# Altium schematic sheet Ports.SchDoc
size A
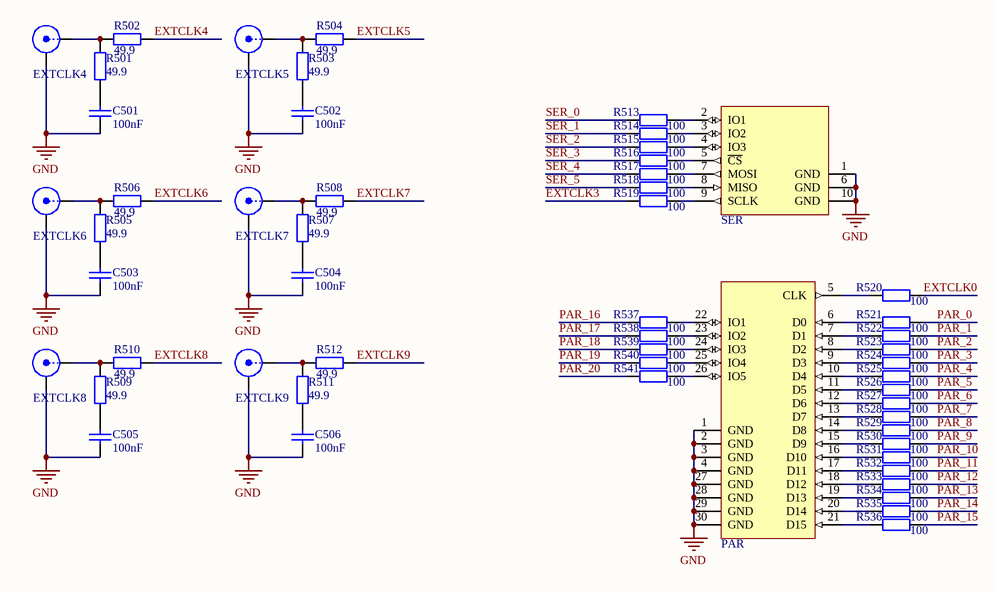
[diagram p0: Ports.SchDoc]

## Parts
C501  value 100nF  [0603C]  (hidden comment: MLCC)
C502  value 100nF  [0603C]  (hidden comment: MLCC)
C503  value 100nF  [0603C]  (hidden comment: MLCC)
C504  value 100nF  [0603C]  (hidden comment: MLCC)
C505  value 100nF  [0603C]  (hidden comment: MLCC)
C506  value 100nF  [0603C]  (hidden comment: MLCC)
EXTCLK4  SMA  [SMA-V-NARROW]  (value not drawn)
EXTCLK5  SMA  [SMA-V-NARROW]  (value not drawn)
EXTCLK6  SMA  [SMA-V-NARROW]  (value not drawn)
EXTCLK7  SMA  [SMA-V-NARROW]  (value not drawn)
EXTCLK8  SMA  [SMA-V-NARROW]  (value not drawn)
EXTCLK9  SMA  [SMA-V-NARROW]  (value not drawn)
PAR  FPGA_PAR_SLAVE  [IDC30]  (value not drawn)
R501  value 49.9  [0603R]  (hidden comment: Resistor)
R502  value 49.9  [0603R]  (hidden comment: Resistor)
R503  value 49.9  [0603R]  (hidden comment: Resistor)
R504  value 49.9  [0603R]  (hidden comment: Resistor)
R505  value 49.9  [0603R]  (hidden comment: Resistor)
R506  value 49.9  [0603R]  (hidden comment: Resistor)
R507  value 49.9  [0603R]  (hidden comment: Resistor)
R508  value 49.9  [0603R]  (hidden comment: Resistor)
R509  value 49.9  [0603R]  (hidden comment: Resistor)
R510  value 49.9  [0603R]  (hidden comment: Resistor)
R511  value 49.9  [0603R]  (hidden comment: Resistor)
R512  value 49.9  [0603R]  (hidden comment: Resistor)
R513  value 100  [0603R]  (hidden comment: Resistor)
R514  value 100  [0603R]  (hidden comment: Resistor)
R515  value 100  [0603R]  (hidden comment: Resistor)
R516  value 100  [0603R]  (hidden comment: Resistor)
R517  value 100  [0603R]  (hidden comment: Resistor)
R518  value 100  [0603R]  (hidden comment: Resistor)
R519  value 100  [0603R]  (hidden comment: Resistor)
R520  value 100  [0603R]  (hidden comment: Resistor)
R521  value 100  [0603R]  (hidden comment: Resistor)
R522  value 100  [0603R]  (hidden comment: Resistor)
R523  value 100  [0603R]  (hidden comment: Resistor)
R524  value 100  [0603R]  (hidden comment: Resistor)
R525  value 100  [0603R]  (hidden comment: Resistor)
R526  value 100  [0603R]  (hidden comment: Resistor)
R527  value 100  [0603R]  (hidden comment: Resistor)
R528  value 100  [0603R]  (hidden comment: Resistor)
R529  value 100  [0603R]  (hidden comment: Resistor)
R530  value 100  [0603R]  (hidden comment: Resistor)
R531  value 100  [0603R]  (hidden comment: Resistor)
R532  value 100  [0603R]  (hidden comment: Resistor)
R533  value 100  [0603R]  (hidden comment: Resistor)
R534  value 100  [0603R]  (hidden comment: Resistor)
R535  value 100  [0603R]  (hidden comment: Resistor)
R536  value 100  [0603R]  (hidden comment: Resistor)
R537  value 100  [0603R]  (hidden comment: Resistor)
R538  value 100  [0603R]  (hidden comment: Resistor)
R539  value 100  [0603R]  (hidden comment: Resistor)
R540  value 100  [0603R]  (hidden comment: Resistor)
R541  value 100  [0603R]  (hidden comment: Resistor)
SER  FPGA_SER_SLAVE  [IDC10]  (value not drawn)

## Nets
GND: C501.1 C502.1 C503.1 C504.1 C505.1 C506.1 EXTCLK4.2(Y) EXTCLK5.2(Y) EXTCLK6.2(Y) EXTCLK7.2(Y) EXTCLK8.2(Y) EXTCLK9.2(Y) PAR.1(GND) PAR.2(GND) PAR.3(GND) PAR.4(GND) PAR.27(GND) PAR.28(GND) PAR.29(GND) PAR.30(GND) SER.1(GND) SER.6(GND) SER.10(GND)
EXTCLK0: R520.2
EXTCLK3: R519.1
EXTCLK4: R502.2
EXTCLK5: R504.2
EXTCLK6: R506.2
EXTCLK7: R508.2
EXTCLK8: R510.2
EXTCLK9: R512.2
PAR_0: R521.2
PAR_1: R522.2
PAR_2: R523.2
PAR_3: R524.2
PAR_4: R525.2
PAR_5: R526.2
PAR_6: R527.2
PAR_7: R528.2
PAR_8: R529.2
PAR_9: R530.2
PAR_10: R531.2
PAR_11: R532.2
PAR_12: R533.2
PAR_13: R534.2
PAR_14: R535.2
PAR_15: R536.2
PAR_16: R537.1
PAR_17: R538.1
PAR_18: R539.1
PAR_19: R540.1
PAR_20: R541.1
SER_0: R513.1
SER_1: R514.1
SER_2: R515.1
SER_3: R516.1
SER_4: R517.1
SER_5: R518.1
NetC501_2: C501.2 R501.1
NetC502_2: C502.2 R503.1
NetC503_2: C503.2 R505.1
NetC504_2: C504.2 R507.1
NetC505_2: C505.2 R509.1
NetC506_2: C506.2 R511.1
NetEXTCLK4_1: EXTCLK4.1(X) R501.2 R502.1
NetEXTCLK5_1: EXTCLK5.1(X) R503.2 R504.1
NetEXTCLK6_1: EXTCLK6.1(X) R505.2 R506.1
NetEXTCLK7_1: EXTCLK7.1(X) R507.2 R508.1
NetEXTCLK8_1: EXTCLK8.1(X) R509.2 R510.1
NetEXTCLK9_1: EXTCLK9.1(X) R511.2 R512.1
NetPAR_5: PAR.5(CLK) R520.1
NetPAR_6: PAR.6(D0) R521.1
NetPAR_7: PAR.7(D1) R522.1
NetPAR_8: PAR.8(D2) R523.1
NetPAR_9: PAR.9(D3) R524.1
NetPAR_10: PAR.10(D4) R525.1
NetPAR_11: PAR.11(D5) R526.1
NetPAR_12: PAR.12(D6) R527.1
NetPAR_13: PAR.13(D7) R528.1
NetPAR_14: PAR.14(D8) R529.1
NetPAR_15: PAR.15(D9) R530.1
NetPAR_16: PAR.16(D10) R531.1
NetPAR_17: PAR.17(D11) R532.1
NetPAR_18: PAR.18(D12) R533.1
NetPAR_19: PAR.19(D13) R534.1
NetPAR_20: PAR.20(D14) R535.1
NetPAR_21: PAR.21(D15) R536.1
NetPAR_22: PAR.22(IO1) R537.2
NetPAR_23: PAR.23(IO2) R538.2
NetPAR_24: PAR.24(IO3) R539.2
NetPAR_25: PAR.25(IO4) R540.2
NetPAR_26: PAR.26(IO5) R541.2
NetR513_2: R513.2 SER.2(IO1)
NetR514_2: R514.2 SER.3(IO2)
NetR515_2: R515.2 SER.4(IO3)
NetR516_2: R516.2 SER.5(~{CS})
NetR517_2: R517.2 SER.7(MOSI)
NetR518_2: R518.2 SER.8(MISO)
NetR519_2: R519.2 SER.9(SCLK)

## Library data of the parts
EXTCLK4-EXTCLK9 = SMA: SMA Connector
PAR = FPGA_PAR_SLAVE: FPGA parallel port
SER = FPGA_SER_SLAVE: FPGA serial port